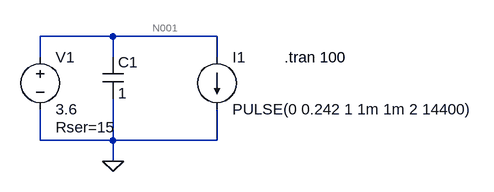
[diagram p0: schematic Simulasi transien daya tugas KP.asc]
Simulasi transien daya tugas KP.asc, the LTspice schematic file:
Version 4
SHEET 1 880 680
WIRE 112 128 0 128
WIRE 272 128 112 128
WIRE 0 160 0 128
WIRE 112 160 112 128
WIRE 272 160 272 128
WIRE 0 288 0 240
WIRE 112 288 112 224
WIRE 112 288 0 288
WIRE 272 288 272 240
WIRE 272 288 112 288
WIRE 112 320 112 288
FLAG 112 320 0
SYMBOL voltage 0 144 R0
WINDOW 123 0 0 Left 0
WINDOW 39 24 124 Left 2
SYMATTR SpiceLine Rser=15
SYMATTR InstName V1
SYMATTR Value 3.6
SYMBOL cap 96 160 R0
SYMATTR InstName C1
SYMATTR Value 1
SYMBOL current 272 160 R0
WINDOW 123 0 0 Left 0
WINDOW 39 0 0 Left 0
SYMATTR InstName I1
SYMATTR Value PULSE(0 0.242 1 1m 1m 2 14400)
TEXT 376 160 Left 2 !.tran 100

The netlist it stands for:
* Simulasi transien daya tugas KP.asc
V1 N001 0 3.6 Rser=15
C1 N001 0 1
I1 N001 0 PULSE(0 0.242 1 1m 1m 2 14400)
.tran 100
.backanno
.end

* Results of the author's LTspice run, read from the files saved beside the schematic
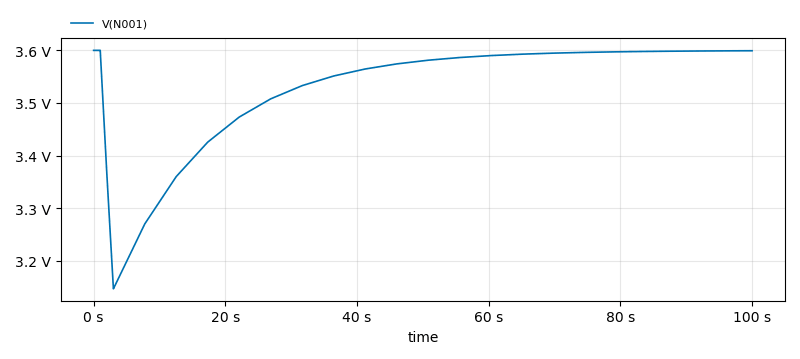
[diagram p1: Transient Analysis of Simulasi transien daya tugas KP.asc, plotted from the saved traces]
* Transient Analysis, 1 run:
*   V(N001): min 3.147 V, max 3.6 V, average 3.527 V, rms 3.529 V, last 3.599 V